# Altium schematic sheet Compensador.SchDoc
size A4
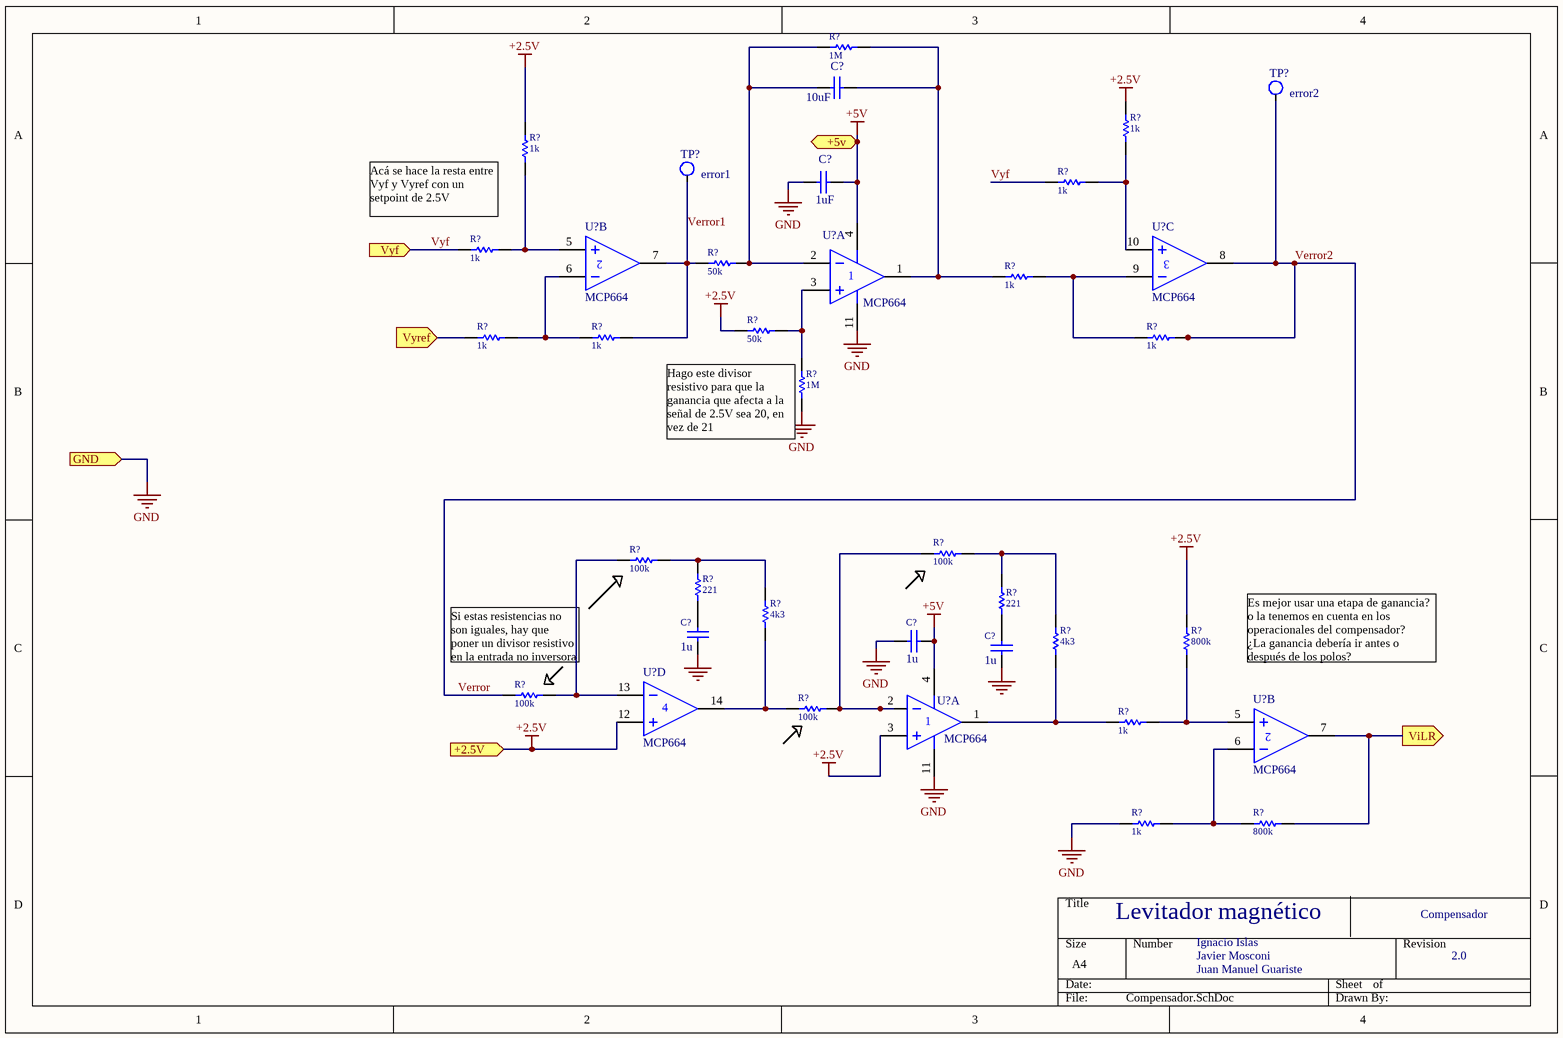
[diagram p0: Compensador.SchDoc]

## Parts
(Parts that share a designator on the sheet are numbered #1, #2 ... from top to bottom, then left to right.)
C?#1  value 10uF  [C1206]  (hidden comment: Cap)
C?#2  value 1uF  [C1206]  (hidden comment: Cap)
C?#3  1u  [C1206]
C?#4  1u  [C1206]
C?#5  1u  [C1206]
R?#1  1M  [R 1206L]
R?#2  1k  [R 1206L]
R?#3  1k  [R 1206L]
R?#4  1k  [R 1206L]
R?#5  1k  [R 1206L]
R?#6  50k  [R 1206L]
R?#7  1k  [R 1206L]
R?#8  50k  [R 1206L]
R?#9  1k  [R 1206L]
R?#10  1k  [R 1206L]
R?#11  1k  [R 1206L]
R?#12  1M  [R 1206L]
R?#13  100k  [R 1206L]
R?#14  100k  [R 1206L]
R?#15  221  [R 1206L]
R?#16  221  [R 1206L]
R?#17  4k3  [R 1206L]
R?#18  4k3  [R 1206L]
R?#19  800k  [R 1206L]
R?#20  100k  [R 1206L]
R?#21  100k  [R 1206L]
R?#22  1k  [R 1206L]
R?#23  1k  [R 1206L]
R?#24  800k  [R 1206L]
TP?#1  error2  [TestPoint Keystone 5000 Silver-Red]
TP?#2  error1  [TestPoint Keystone 5000 Silver-Red]
U?#1  MCP664  [SOIC14]  (part B of 4)
U?#2  MCP664  [SOIC14]  (part C of 4)
U?#3  MCP664  [SOIC14]  (part A of 4)
U?#4  MCP664  [SOIC14]  (part D of 4)
U?#5  MCP664  [SOIC14]  (part A of 4)
U?#6  MCP664  [SOIC14]  (part B of 4)

## Ports
+2.5V (in), +5v (in), GND (in), ViLR (out), Vyf (in), Vyref (in)

## Nets
+2.5V: R?#2.2 R?#3.2 R?#8.1 R?#19.2 U?#4.12(IN+) U?#5.3(IN+) ; port +2.5V
+5V: C?#2.2 C?#4.1 U?#3.4(V+) U?#5.4(V+) ; port +5v
GND: C?#2.1 C?#3.1 C?#4.2 C?#5.1 R?#12.1 R?#23.1 U?#3.11(V-) U?#5.11(V-) ; port GND
Verror: R?#11.2 R?#20.1 TP?#1.1 U?#2.8(OUT)  [also labelled Verror2]
Verror1: R?#6.1 R?#10.2 TP?#2.1 U?#1.7(OUT)
ViLR: R?#24.2 U?#6.7(OUT) ; port ViLR
Vyf: R?#4.1 R?#5.1 ; port Vyf
Vyref: R?#9.1 ; port Vyref
NetC?#1_1: C?#1.1 R?#1.1 R?#6.2 U?#3.2(IN-)
NetC?#1_2: C?#1.2 R?#1.2 R?#7.1 U?#3.1(OUT)
NetC?#3_2: C?#3.2 R?#15.1
NetC?#5_2: C?#5.2 R?#16.1
NetR?#2_1: R?#2.1 R?#4.2 U?#2.10(IN+)
NetR?#3_1: R?#3.1 R?#5.2 U?#1.5(IN+)
NetR?#7_2: R?#7.2 R?#11.1 U?#2.9(IN-)
NetR?#8_2: R?#8.2 R?#12.2 U?#3.3(IN+)
NetR?#9_2: R?#9.2 R?#10.1 U?#1.6(IN-)
NetR?#13_1: R?#13.1 R?#21.2 U?#5.2(IN-)
NetR?#13_2: R?#13.2 R?#16.2 R?#18.1
NetR?#14_1: R?#14.1 R?#20.2 U?#4.13(IN-)
NetR?#14_2: R?#14.2 R?#15.2 R?#17.1
NetR?#17_2: R?#17.2 R?#21.1 U?#4.14(OUT)
NetR?#18_2: R?#18.2 R?#22.1 U?#5.1(OUT)
NetR?#19_1: R?#19.1 R?#22.2 U?#6.5(IN+)
NetR?#23_2: R?#23.2 R?#24.1 U?#6.6(IN-)

## Notes on the sheet
- (near R?#3) Acá se hace la resta entre Vyf y Vyref con un setpoint de 2.5V
- (near R?#12) Hago este divisor resistivo para que la ganancia que afecta a la señal de 2.5V sea 20, en vez de 21
- (near R?#20) Si estas resistencias no son iguales, hay que poner un divisor resistivo en la entrada no inversora
- Es mejor usar una etapa de ganancia? o la tenemos en cuenta en los operacionales del compensador?
  ¿La ganancia debería ir antes o después de los polos?
- Levitador magnético
- Compensador
- Ignacio Islas
- Javier Mosconi
- Juan Manuel Guariste
- 2.0

## Library data of the parts
C?#1 C?#2 = Cap: Capacitor; Published: 8-Jun-2000; LatestRevisionDate: 17-Jul-2002; LatestRevisionNote: Re-released for DXP Platform.; PackageReference: RAD-0.3; Publisher: Altium Limited; PackageDescription: Radial Cap, Thru-Hole; 2 Leads; 0.3 in Pin Spacing
C?#3-C?#5 = C1206: Capacitor Chip 1206; Dielectric: NP0; Voltage: 50V; Published: 8-Jun-2000; LatestRevisionDate: 26/08/2013; LatestRevisionNote: IPC-7351 Footprint Added.; PackageReference: 1206; Publisher: Altium Limited; PackageDescription: Chip Capacitor; Supplier 1: Digi-Key; Value: 1u
R?#1-R?#24 = R1206: Resistor Chip; 1/8W;; Published: 8-Jun-2000; LatestRevisionDate: 26/8/2013; PackageReference: 1206; Publisher: Altium Limited; PackageDescription: SMT Chip Resistor; Supplier 1: Digi-Key
  R?#1 R?#12: Value: 1M
  R?#2-R?#5 R?#7 R?#9-R?#11 R?#22 R?#23: Value: 1k
  R?#6 R?#8: Value: 50k
  R?#13 R?#14 R?#20 R?#21: Value: 100k
  R?#15 R?#16: Value: 221
  R?#17 R?#18: Value: 4k3
  R?#19 R?#24: Value: 800k
TP?#1 TP?#2 = Tespoint: Test point
U?#1-U?#6 = MCP664: Datasheet: https://ar.mouser.com/datasheet/2/268/22194B-77503.pdf